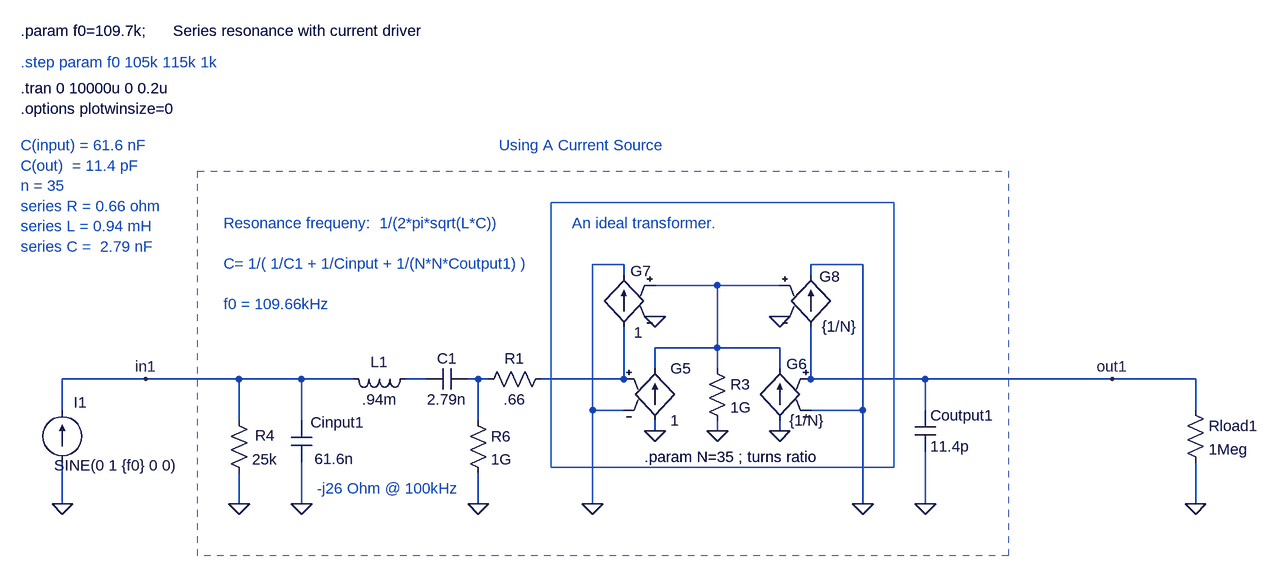
[diagram p0: schematic piezo_electric_transformer_i.asc]
piezo_electric_transformer_i.asc, the LTspice schematic file:
Version 4
SHEET 1 1732 1364
WIRE -704 928 -704 880
WIRE -704 1072 -704 1008
WIRE -576 880 -704 880
WIRE -432 880 -576 880
WIRE -432 944 -432 880
WIRE -432 1072 -432 1024
WIRE -336 880 -432 880
WIRE -336 944 -336 880
WIRE -336 1072 -336 1008
WIRE -320 1072 -336 1072
WIRE -256 880 -336 880
WIRE -144 880 -176 880
WIRE -64 880 -80 880
WIRE -64 944 -64 880
WIRE -64 1072 -64 1024
WIRE -48 880 -64 880
WIRE 112 928 112 704
WIRE 112 1072 112 928
WIRE 160 704 112 704
WIRE 160 720 160 704
WIRE 160 880 32 880
WIRE 160 880 160 800
WIRE 160 928 112 928
WIRE 208 864 208 832
WIRE 208 960 208 944
WIRE 304 736 208 736
WIRE 304 832 208 832
WIRE 304 832 304 736
WIRE 304 864 304 832
WIRE 304 960 304 944
WIRE 400 736 304 736
WIRE 400 832 304 832
WIRE 400 864 400 832
WIRE 400 960 400 944
WIRE 448 720 448 704
WIRE 448 880 448 800
WIRE 528 704 448 704
WIRE 528 928 448 928
WIRE 528 928 528 704
WIRE 528 1072 528 928
WIRE 624 880 448 880
WIRE 624 928 624 880
WIRE 624 1072 624 992
WIRE 912 880 624 880
WIRE 1040 880 912 880
WIRE 1040 928 1040 880
WIRE 1040 1072 1040 1008
FLAG -704 1072 0
FLAG 400 960 0
FLAG 208 960 0
FLAG 208 784 0
FLAG 400 784 0
FLAG 304 960 0
FLAG 112 1072 0
FLAG 528 1072 0
FLAG 1040 1072 0
FLAG -336 1072 0
FLAG 624 1072 0
FLAG -432 1072 0
FLAG 912 880 out1
FLAG -576 880 in1
FLAG -64 1072 0
SYMBOL res 48 864 R90
WINDOW 0 0 56 VBottom 0
WINDOW 3 32 56 VTop 0
SYMATTR InstName R1
SYMATTR Value .66
SYMBOL g 208 848 R0
SYMATTR InstName G5
SYMATTR Value 1
SYMBOL g 400 848 M0
WINDOW 0 -10 9 Right 0
WINDOW 3 -15 96 Right 0
SYMATTR InstName G6
SYMATTR Value {1/N}
SYMBOL g 160 704 M0
WINDOW 0 -10 10 Right 0
WINDOW 3 -16 104 Right 0
SYMATTR InstName G7
SYMATTR Value 1
SYMBOL g 448 704 R0
WINDOW 0 13 18 Left 0
WINDOW 3 17 95 Left 0
SYMATTR InstName G8
SYMATTR Value {1/N}
SYMBOL res 288 848 R0
SYMATTR InstName R3
SYMATTR Value 1G
SYMBOL res 1024 912 R0
SYMATTR InstName Rload1
SYMATTR Value 1Meg
SYMBOL cap -352 944 R0
WINDOW 0 30 3 Left 0
WINDOW 3 36 59 Left 0
SYMATTR InstName Cinput1
SYMATTR Value 61.6n
SYMBOL cap 608 928 R0
SYMATTR InstName Coutput1
SYMATTR Value 11.4p
SYMBOL ind -160 864 R90
WINDOW 0 5 56 VBottom 0
WINDOW 3 32 56 VTop 0
SYMATTR InstName L1
SYMATTR Value .94m
SYMBOL cap -80 864 R90
WINDOW 0 0 32 VBottom 0
WINDOW 3 32 32 VTop 0
SYMATTR InstName C1
SYMATTR Value 2.79n
SYMBOL current -704 1008 R180
WINDOW 0 -38 92 Left 0
WINDOW 3 -177 -5 Left 0
WINDOW 123 0 0 Left 0
WINDOW 39 0 0 Left 0
SYMATTR InstName I1
SYMATTR Value SINE(0 1 {f0} 0 0)
SYMBOL res -448 928 R0
WINDOW 0 41 39 Left 0
SYMATTR InstName R4
SYMATTR Value 25k
SYMBOL res -80 928 R0
SYMATTR InstName R6
SYMATTR Value 1G
TEXT -768 432 Left 0 !.tran 0 10000u 0 0.2u
TEXT -768 520 Left 0 ;C(input) = 61.6 nF\nC(out)  = 11.4 pF\nn = 35\nseries R = 0.66 ohm\nseries L = 0.94 mH\nseries C =  2.79 nF
TEXT -768 464 Left 0 !.options plotwinsize=0
TEXT -768 392 Left 0 ;.step param f0 105k 115k 1k
TEXT -768 344 Left 0 !.param f0=109.7k;      Series resonance with current driver
TEXT 80 640 Left 0 ;An ideal transformer.
TEXT 192 1000 Left 0 !.param N=35 ; turns ratio
TEXT -312 1048 Left 0 ;-j26 Ohm @ 100kHz
TEXT -456 640 Left 0 ;Resonance frequeny:  1/(2*pi*sqrt(L*C))\n \nC= 1/( 1/C1 + 1/Cinput + 1/(N*N*Coutput1) )\n \nf0 = 109.66kHz
TEXT -32 520 Left 0 ;Using A Current Source
RECTANGLE Normal 576 1016 48 608
RECTANGLE Normal 752 1152 -496 560 1

The netlist it stands for:
* piezo_electric_transformer_i.asc
R1 N003 N002 .66
G5 0 N004 N003 0 1
G6 0 N004 out1 0 {1/N}
G7 N003 0 N004 0 1
G8 out1 0 N004 0 {1/N}
R3 N004 0 1G
Rload1 out1 0 1Meg
Cinput1 in1 0 61.6n
Coutput1 out1 0 11.4p
L1 N001 in1 .94m
C1 N002 N001 2.79n
I1 0 in1 SINE(0 1 {f0} 0 0)
R4 in1 0 25k
R6 N002 0 1G
.tran 0 10000u 0 0.2u
* C(input) = 61.6 nF
* C(out)  = 11.4 pF
* n = 35
* series R = 0.66 ohm
* series L = 0.94 mH
* series C =  2.79 nF
.options plotwinsize=0
* .step param f0 105k 115k 1k
.param f0=109.7k;      Series resonance with current driver
* An ideal transformer.
.param N=35 ; turns ratio
* -j26 Ohm @ 100kHz
* Resonance frequeny:  1/(2*pi*sqrt(L*C))
* C= 1/( 1/C1 + 1/Cinput + 1/(N*N*Coutput1) )
* f0 = 109.66kHz
* Using A Current Source
.backanno
.end